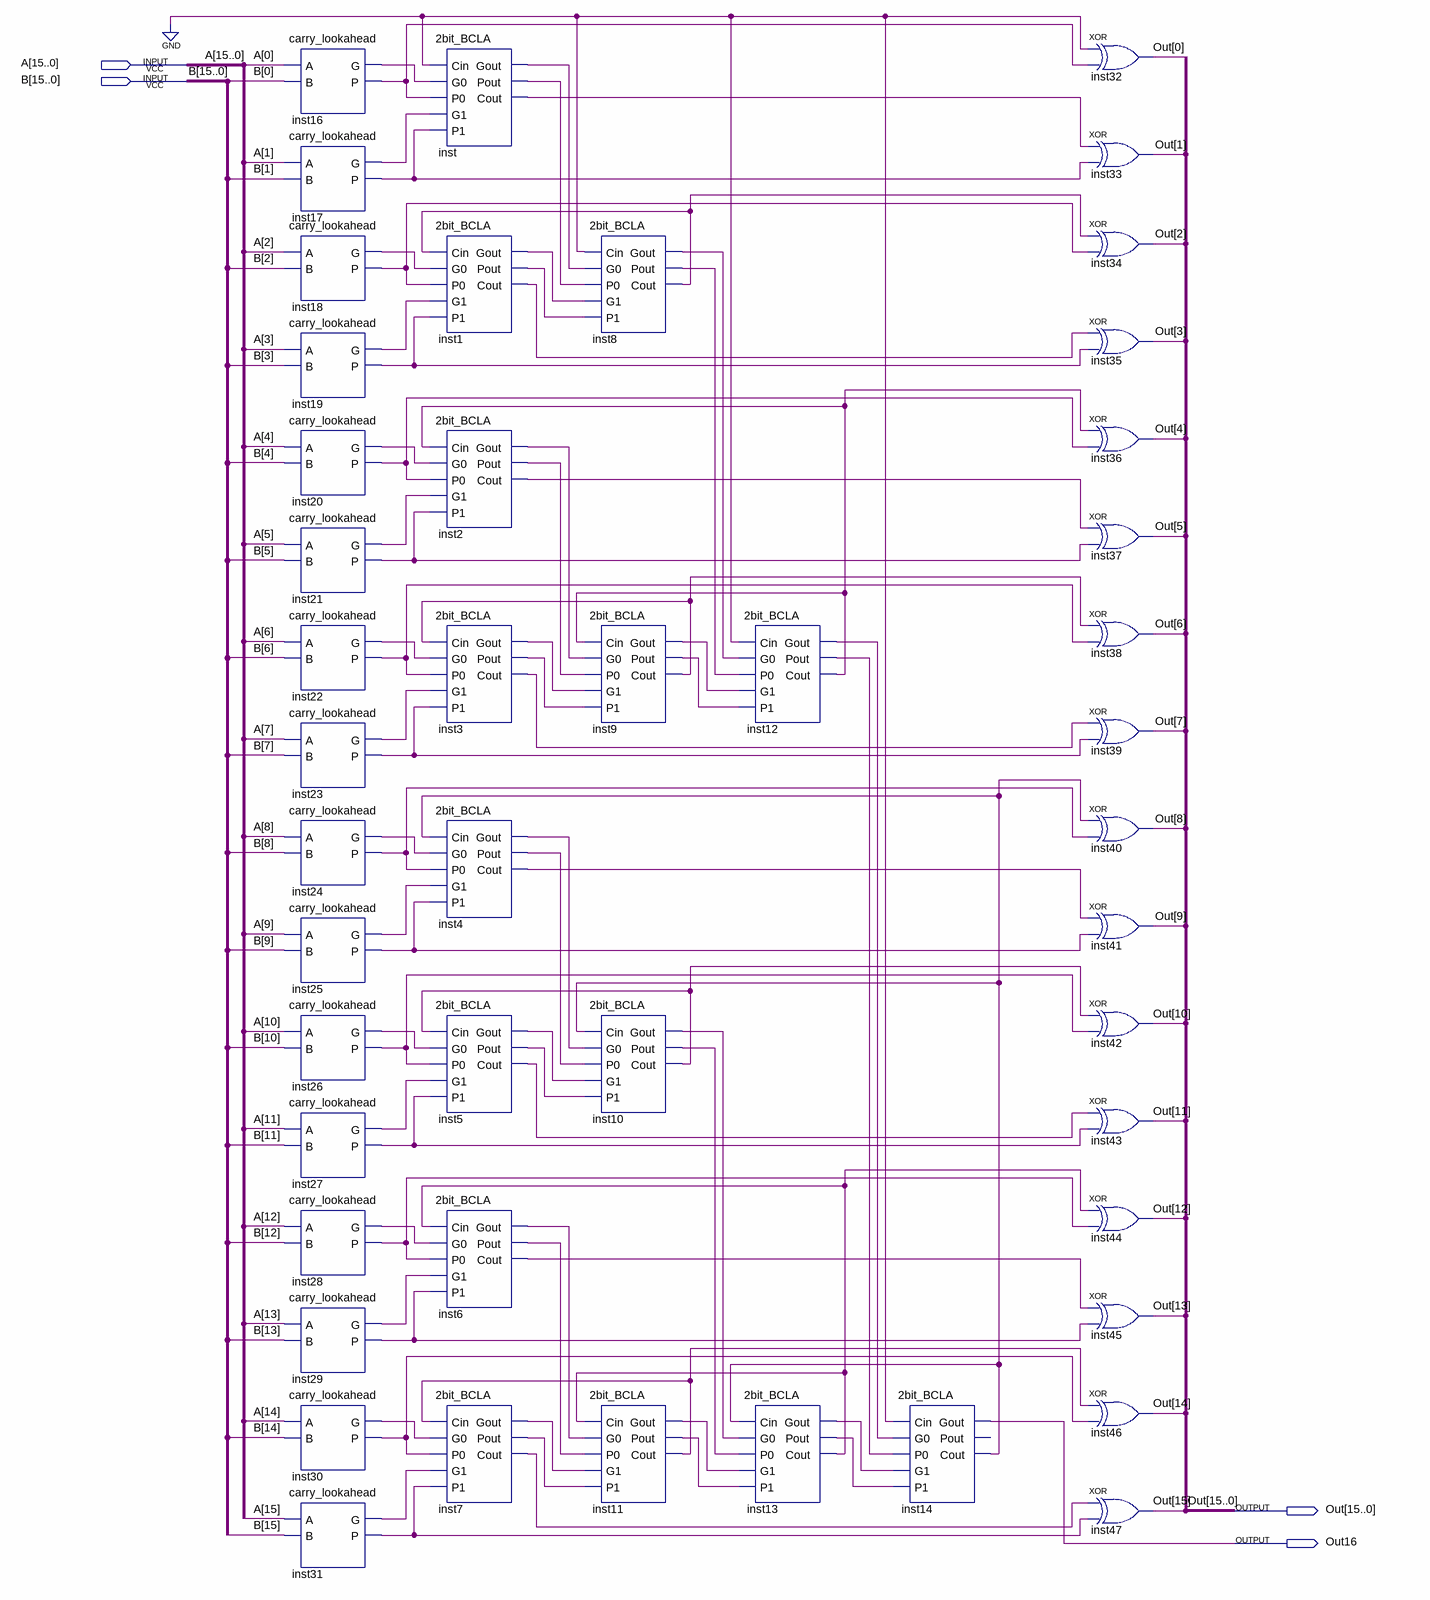
[diagram p0: schematic sheet]
// Quartus schematic 16bit_fulladder.bdf as structural Verilog: 47 symbols, 4 pins
module \16bit_fulladder  (
  input  [15:0] A,
  input  [15:0] B,
  output [15:0] Out,
  output Out16
);

  wire inst1_cout, inst1_gout, inst1_pout, inst2_cout, inst2_gout, inst2_pout, inst3_cout, inst3_gout,
       inst3_pout, inst4_cout, inst4_gout, inst4_pout, inst5_cout, inst5_gout, inst5_pout, inst6_cout,
       inst6_gout, inst6_pout, inst7_cout, inst7_gout, inst7_pout, inst8_cout, inst8_gout, inst8_pout,
       inst9_cout, inst9_gout, inst9_pout, inst10_cout, inst10_gout, inst10_pout, inst11_cout, inst11_gout,
       inst11_pout, inst12_cout, inst12_gout, inst12_pout, inst13_cout, inst13_gout, inst13_pout,
       inst14_cout, inst16_g, inst16_p, inst17_g, inst17_p, inst18_g, inst18_p, inst19_g, inst19_p, inst20_g,
       inst20_p, inst21_g, inst21_p, inst22_g, inst22_p, inst23_g, inst23_p, inst24_g, inst24_p, inst25_g,
       inst25_p, inst26_g, inst26_p, inst27_g, inst27_p, inst28_g, inst28_p, inst29_g, inst29_p, inst30_g,
       inst30_p, inst31_g, inst31_p, inst_cout, inst_gout, inst_pout;

  carry_lookahead inst16 (.A(A[0]), .B(B[0]), .G(inst16_g), .P(inst16_p));
  carry_lookahead inst17 (.A(A[1]), .B(B[1]), .G(inst17_g), .P(inst17_p));
  carry_lookahead inst18 (.A(A[2]), .B(B[2]), .G(inst18_g), .P(inst18_p));
  carry_lookahead inst19 (.A(A[3]), .B(B[3]), .G(inst19_g), .P(inst19_p));
  carry_lookahead inst20 (.A(A[4]), .B(B[4]), .G(inst20_g), .P(inst20_p));
  carry_lookahead inst21 (.A(A[5]), .B(B[5]), .G(inst21_g), .P(inst21_p));
  carry_lookahead inst22 (.A(A[6]), .B(B[6]), .G(inst22_g), .P(inst22_p));
  carry_lookahead inst23 (.A(A[7]), .B(B[7]), .G(inst23_g), .P(inst23_p));
  carry_lookahead inst24 (.A(A[8]), .B(B[8]), .G(inst24_g), .P(inst24_p));
  carry_lookahead inst25 (.A(A[9]), .B(B[9]), .G(inst25_g), .P(inst25_p));
  carry_lookahead inst26 (.A(A[10]), .B(B[10]), .G(inst26_g), .P(inst26_p));
  carry_lookahead inst27 (.A(A[11]), .B(B[11]), .G(inst27_g), .P(inst27_p));
  carry_lookahead inst28 (.A(A[12]), .B(B[12]), .G(inst28_g), .P(inst28_p));
  carry_lookahead inst29 (.A(A[13]), .B(B[13]), .G(inst29_g), .P(inst29_p));
  carry_lookahead inst30 (.A(A[14]), .B(B[14]), .G(inst30_g), .P(inst30_p));
  carry_lookahead inst31 (.A(A[15]), .B(B[15]), .G(inst31_g), .P(inst31_p));
  \2bit_BCLA  inst (
    .Cin(1'b0), .G0(inst16_g), .P0(inst16_p), .G1(inst17_g), .P1(inst17_p), .Gout(inst_gout),
    .Pout(inst_pout), .Cout(inst_cout));
  \2bit_BCLA  inst1 (
    .Cin(inst8_cout), .G0(inst18_g), .P0(inst18_p), .G1(inst19_g), .P1(inst19_p), .Gout(inst1_gout),
    .Pout(inst1_pout), .Cout(inst1_cout));
  \2bit_BCLA  inst2 (
    .Cin(inst12_cout), .G0(inst20_g), .P0(inst20_p), .G1(inst21_g), .P1(inst21_p), .Gout(inst2_gout),
    .Pout(inst2_pout), .Cout(inst2_cout));
  \2bit_BCLA  inst3 (
    .Cin(inst9_cout), .G0(inst22_g), .P0(inst22_p), .G1(inst23_g), .P1(inst23_p), .Gout(inst3_gout),
    .Pout(inst3_pout), .Cout(inst3_cout));
  \2bit_BCLA  inst4 (
    .Cin(inst14_cout), .G0(inst24_g), .P0(inst24_p), .G1(inst25_g), .P1(inst25_p), .Gout(inst4_gout),
    .Pout(inst4_pout), .Cout(inst4_cout));
  \2bit_BCLA  inst5 (
    .Cin(inst10_cout), .G0(inst26_g), .P0(inst26_p), .G1(inst27_g), .P1(inst27_p), .Gout(inst5_gout),
    .Pout(inst5_pout), .Cout(inst5_cout));
  \2bit_BCLA  inst6 (
    .Cin(inst13_cout), .G0(inst28_g), .P0(inst28_p), .G1(inst29_g), .P1(inst29_p), .Gout(inst6_gout),
    .Pout(inst6_pout), .Cout(inst6_cout));
  \2bit_BCLA  inst7 (
    .Cin(inst11_cout), .G0(inst30_g), .P0(inst30_p), .G1(inst31_g), .P1(inst31_p), .Gout(inst7_gout),
    .Pout(inst7_pout), .Cout(inst7_cout));
  \2bit_BCLA  inst8 (
    .Cin(1'b0), .G0(inst_gout), .P0(inst_pout), .G1(inst1_gout), .P1(inst1_pout), .Gout(inst8_gout),
    .Pout(inst8_pout), .Cout(inst8_cout));
  \2bit_BCLA  inst9 (
    .Cin(inst12_cout), .G0(inst2_gout), .P0(inst2_pout), .G1(inst3_gout), .P1(inst3_pout), .Gout(inst9_gout),
    .Pout(inst9_pout), .Cout(inst9_cout));
  \2bit_BCLA  inst10 (
    .Cin(inst14_cout), .G0(inst4_gout), .P0(inst4_pout), .G1(inst5_gout), .P1(inst5_pout),
    .Gout(inst10_gout), .Pout(inst10_pout), .Cout(inst10_cout));
  \2bit_BCLA  inst11 (
    .Cin(inst13_cout), .G0(inst6_gout), .P0(inst6_pout), .G1(inst7_gout), .P1(inst7_pout),
    .Gout(inst11_gout), .Pout(inst11_pout), .Cout(inst11_cout));
  \2bit_BCLA  inst12 (
    .Cin(1'b0), .G0(inst8_gout), .P0(inst8_pout), .G1(inst9_gout), .P1(inst9_pout), .Gout(inst12_gout),
    .Pout(inst12_pout), .Cout(inst12_cout));
  \2bit_BCLA  inst13 (
    .Cin(inst14_cout), .G0(inst10_gout), .P0(inst10_pout), .G1(inst11_gout), .P1(inst11_pout),
    .Gout(inst13_gout), .Pout(inst13_pout), .Cout(inst13_cout));
  \2bit_BCLA  inst14 (
    .Cin(1'b0), .G0(inst12_gout), .P0(inst12_pout), .G1(inst13_gout), .P1(inst13_pout), .Gout(Out16),
    .Cout(inst14_cout));  // open: Pout
  xor inst32 (Out[0], 1'b0, inst16_p);
  xor inst33 (Out[1], inst_cout, inst17_p);
  xor inst34 (Out[2], inst8_cout, inst18_p);
  xor inst35 (Out[3], inst1_cout, inst19_p);
  xor inst36 (Out[4], inst12_cout, inst20_p);
  xor inst37 (Out[5], inst2_cout, inst21_p);
  xor inst38 (Out[6], inst9_cout, inst22_p);
  xor inst39 (Out[7], inst3_cout, inst23_p);
  xor inst40 (Out[8], inst14_cout, inst24_p);
  xor inst41 (Out[9], inst4_cout, inst25_p);
  xor inst42 (Out[10], inst10_cout, inst26_p);
  xor inst43 (Out[11], inst5_cout, inst27_p);
  xor inst44 (Out[12], inst13_cout, inst28_p);
  xor inst45 (Out[13], inst6_cout, inst29_p);
  xor inst46 (Out[14], inst11_cout, inst30_p);
  xor inst47 (Out[15], inst7_cout, inst31_p);
endmodule
